# EAGLE design USBRA13a (EAGLE 5.11)
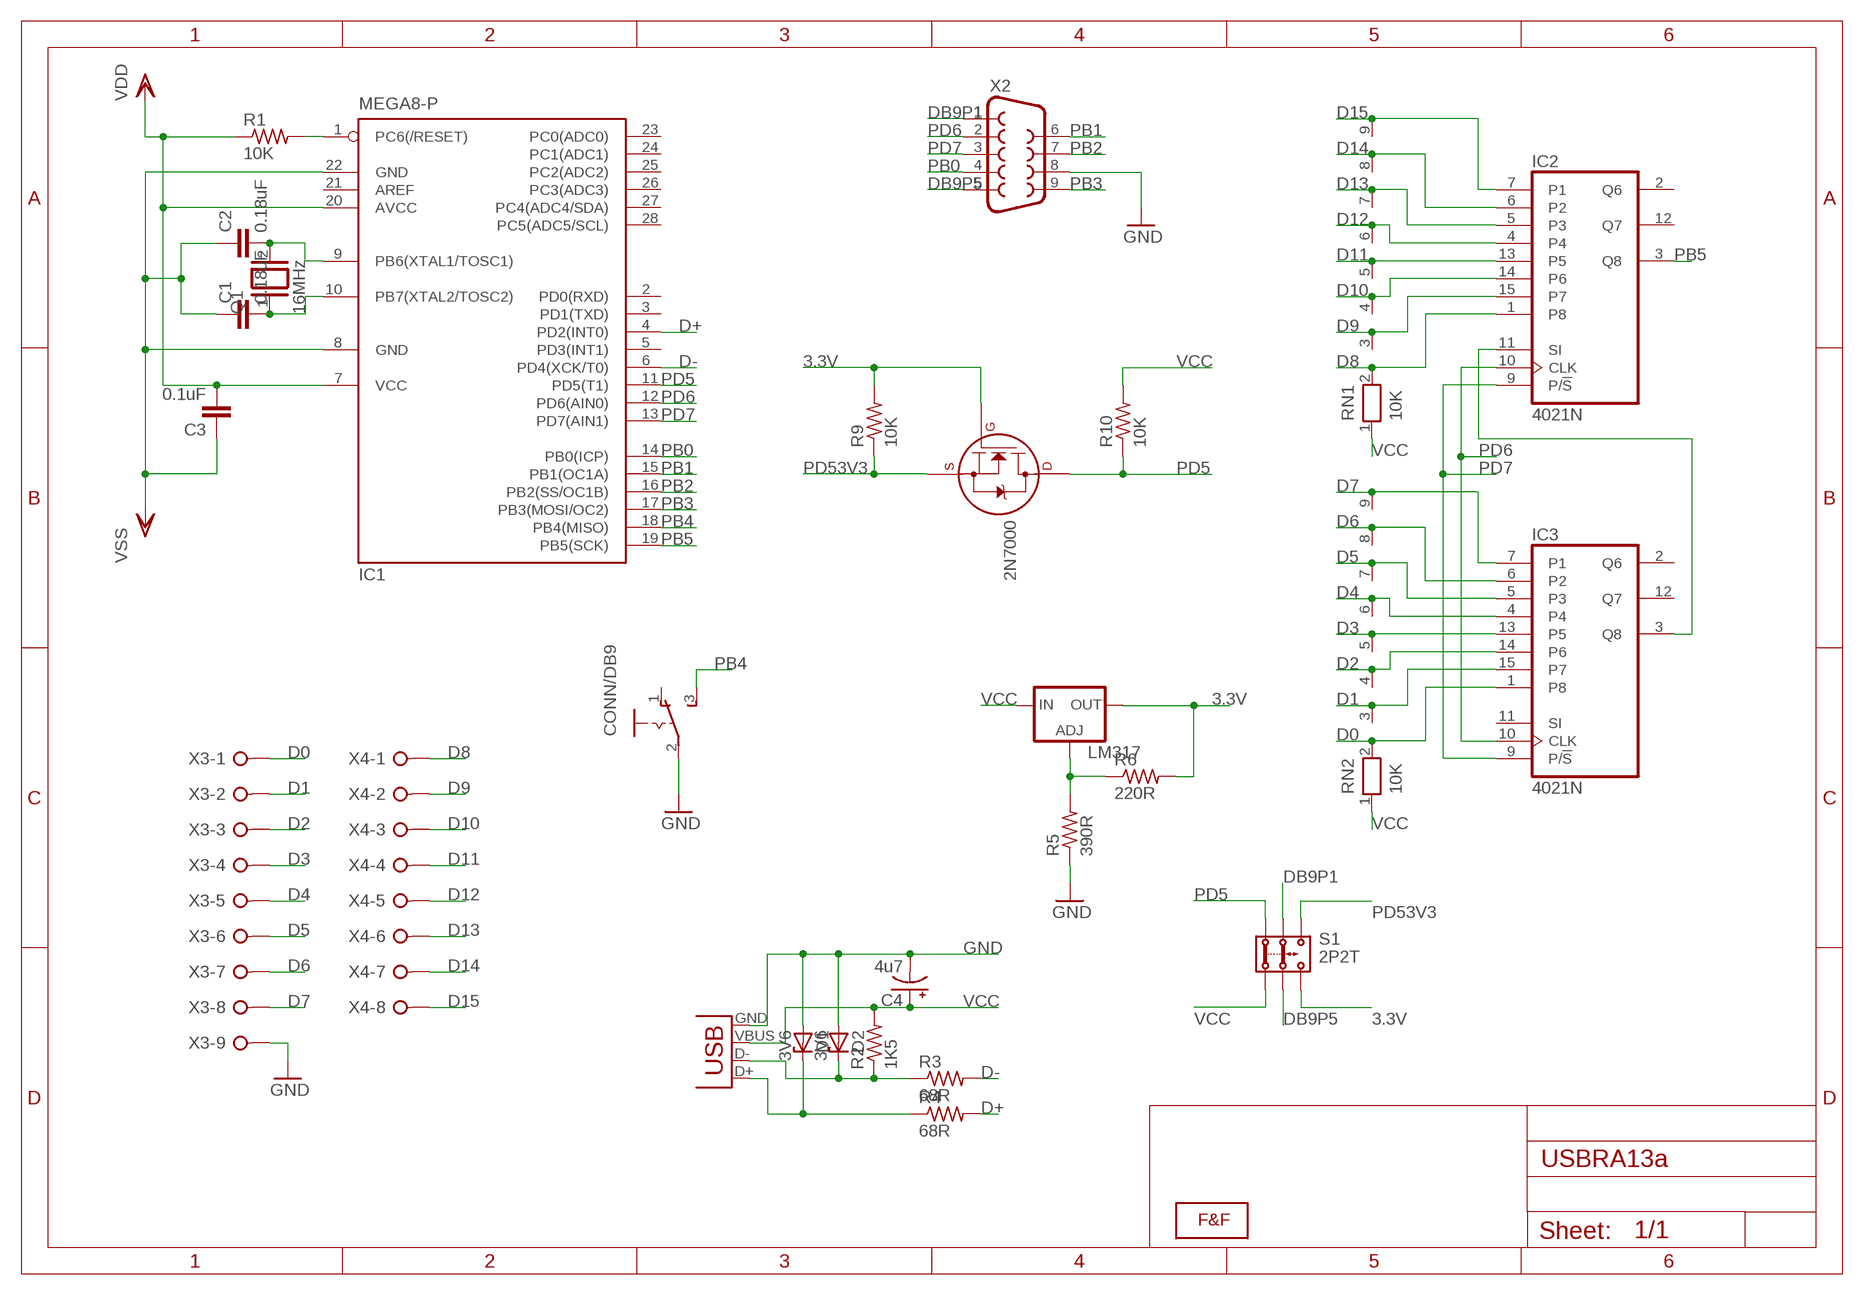
[diagram p0: schematic, sheet 1]

## Parts
2N7000  2N7000_TO92  [TO-92]
C1  0.18uF  C-EU050-024X044  [C050-024X044]
C2  0.18uF  C-EU050-024X044  [C050-024X044]
C3  0.1uF  C-EU050-024X044  [C050-024X044]
C4  4u7  CPOL-USE2.5-6  [E2,5-6]
CONN/DB9  CHAVE  [CHAVE]
D1  3V6  ZENER-DIODEZD-5  [ZDIO-5]
D2  3V6  ZENER-DIODEZD-5  [ZDIO-5]
IC1  MEGA8-P  [DIL28-3]
IC2  4021N  [DIL16]
IC3  4021N  [DIL16]
LM317  LM317TS  [317TS]
Q1  16MHz  XTAL/S  [QS]
R1  10K  R-US_0207/10  [0207/10]
R2  1K5  R-US_0207/10  [0207/10]
R3  68R  R-US_0207/10  [0207/10]
R4  68R  R-US_0207/10  [0207/10]
R5  390R  R-US_0207/10  [0207/10]
R6  220R  R-US_0207/10  [0207/10]
R9  10K  R-US_0207/10  [0207/10]
R10  10K  R-US_0207/10  [0207/10]
RN1  10K  RN08  [RN-9]
RN2  10K  RN08  [RN-9]
S1  2P2T  [2P2T]
U$1  LOGOLOGO_WITHOUT_SMOKE_BIG  [LOGO2_BIG]
X1  USBPTH  [USB-B-PTH]
X2  DB9MALE  [DB9_MALE]
X3  W237-09P  [W237-9P]
X4  W237-08P  [W237-8P]

## Nets
3.3V: 2N7000.2(G) LM317.2(OUT) R6.2 R9.2 S1.3.2
D0: IC3.1(P8) RN2.2 X3.1
D1: IC3.15(P7) RN2.3 X3.2
D2: IC3.14(P6) RN2.4 X3.3
D3: IC3.13(P5) RN2.5 X3.4
D4: IC3.4 RN2.6 X3.5
D5: IC3.5(P3) RN2.7 X3.6
D6: IC3.6(P2) RN2.8 X3.7
D7: IC3.7(P1) RN2.9 X3.8
D8: IC2.1(P8) RN1.2 X4.1
D9: IC2.15(P7) RN1.3 X4.2
D10: IC2.14(P6) RN1.4 X4.3
D11: IC2.13(P5) RN1.5 X4.4
D12: IC2.4 RN1.6 X4.5
D13: IC2.5(P3) RN1.7 X4.6
D14: IC2.6(P2) RN1.8 X4.7
D15: IC2.7(P1) RN1.9 X4.8
D+: IC1.4(PD2(INT0)) R4.2
D-: IC1.6(PD4(XCK/T0)) R3.2
DB9P1: S1.2.1 X2.1
DB9P5: S1.2.2 X2.5
GND: C1.1 C2.1 C3.1 C4.- CONN/DB9.2(P) D1.A D2.A IC1.8(GND) IC1.22(GND) R5.1 X1.GND X2.8 X3.9 ; supply symbol labelled VSS
N$1: IC1.1(PC6(/RESET)) R1.2
N$2: C2.2 IC1.9(PB6(XTAL1/TOSC1)) Q1.2
N$3: C1.2 IC1.10(PB7(XTAL2/TOSC2)) Q1.1
N$4: IC2.11(SI) IC3.3(Q8)
N$5: LM317.1(ADJ) R5.2 R6.1
N$8: D1.C R4.1 X1.D+
N$9: D2.C R2.1 R3.1 X1.D-
PB0: IC1.14(PB0(ICP)) X2.4
PB1: IC1.15(PB1(OC1A)) X2.6
PB2: IC1.16(PB2(SS/OC1B)) X2.7
PB3: IC1.17(PB3(MOSI/OC2)) X2.9
PB4: CONN/DB9.3(S) IC1.18(PB4(MISO))
PB5: IC1.19(PB5(SCK)) IC2.3(Q8)
PD5: 2N7000.3(D) IC1.11(PD5(T1)) R10.1 S1.1.1
PD6: IC1.12(PD6(AIN0)) IC2.10(CLK) IC3.10(CLK) X2.2
PD7: IC1.13(PD7(AIN1)) IC2.9(P/!S) IC3.9(P/!S) X2.3
PD53V3: 2N7000.1(S) R9.1 S1.3.1
VCC: C3.2 C4.+ IC1.7(VCC) IC1.20(AVCC) LM317.3(IN) R1.1 R2.2 R10.2 RN1.1 RN2.1 S1.1.2 X1.VBUS ; supply symbol labelled VDD
Unconnected: CONN/DB9.1(O) IC1.2(PD0(RXD)) IC1.3(PD1(TXD)) IC1.5(PD3(INT1)) IC1.21(AREF) IC1.23(PC0(ADC0)) IC1.24(PC1(ADC1)) IC1.25(PC2(ADC2)) IC1.26(PC3(ADC3)) IC1.27(PC4(ADC4/SDA)) IC1.28(PC5(ADC5/SCL)) IC2.2(Q6) IC2.12(Q7) IC3.2(Q6) IC3.11(SI) IC3.12(Q7)

## Power pins joined to a net without a drawn wire
GND: IC2.8(VSS) IC3.8(VSS)
VCC: IC2.16(VDD) IC3.16(VDD)

## Library data of the parts
2N7000 = transistors:2N700*: 2N7000, 2N7002, NDS7002A N-channel enhancement mode MOSFET
C1-C3 = rcl:C-EU: CAPACITOR, European symbol
C4 = adafruit:CPOL-US: POLARIZED CAPACITOR, American symbol
CONN/DB9 = switch-fef:CHAVE: chave Verificar
D1 D2 = diode:ZENER-DIODE: Z-Diode
IC1 = atmel:MEGA8-P: MICROCONTROLLER 8 Kbytes FLASH, 1 kbytes SRAM, 512 bytes EEPROM, USART, 4-channel 10 bit ADC, 2-channel 8 bit ADC Pin compatible with Atmega48, ATMega88, ATMega168 Source: avr.lbr; OC_FARNELL: unknown; OC_NEWARK: unknown
IC2 IC3 = 40xx:4021: 8-bit static SHIFT REGISTER
LM317 = v-reg:LM317TS: VOLTAGE REGULATOR
Q1 = special:XTAL/S: CRYSTAL
R1-R6 R9 R10 = adafruit:R-US_: RESISTOR, American symbol
RN1 RN2 = resistor-net:RN08: RESISTOR NETWORK; OC_FARNELL: unknown; OC_NEWARK: unknown
S1 = Itead_BP_110825:2P2T: BAS011
U$1 = F&F:LOGO: Faísca e Fumaça Logo faiscaefumaca.com.br
X1 = SparkFun:USB: USB Connectors USB-B-PTH is fully proven SKU : PRT-00139 USB-miniB is fully proven SKU : PRT-00587 USB-A-PCB is untested. USB-A-H is throughly reviewed, but untested. Spark Fun Electronics SKU : PRT-00437 USB-B-SMT is throughly reviewed, but untested. Needs silkscreen touching up. USB-A-S has not been used/tested USB-MB-H has not been used/tested
X2 = SparkFun:DB9: DB9 Connector Standard DB9 (D-Sub 9) serial connector. Can be used for CAN bus as well as RS485 and RS232. Footprint production proven. Spark Fun Electronics SKU : PRT-00429
X3 = con-wago-508:W237-09P: WAGO SREW CLAMP; OC_FARNELL: unknown; OC_NEWARK: unknown
X4 = con-wago-508:W237-08P: WAGO SREW CLAMP; OC_FARNELL: unknown; OC_NEWARK: unknown

## Board
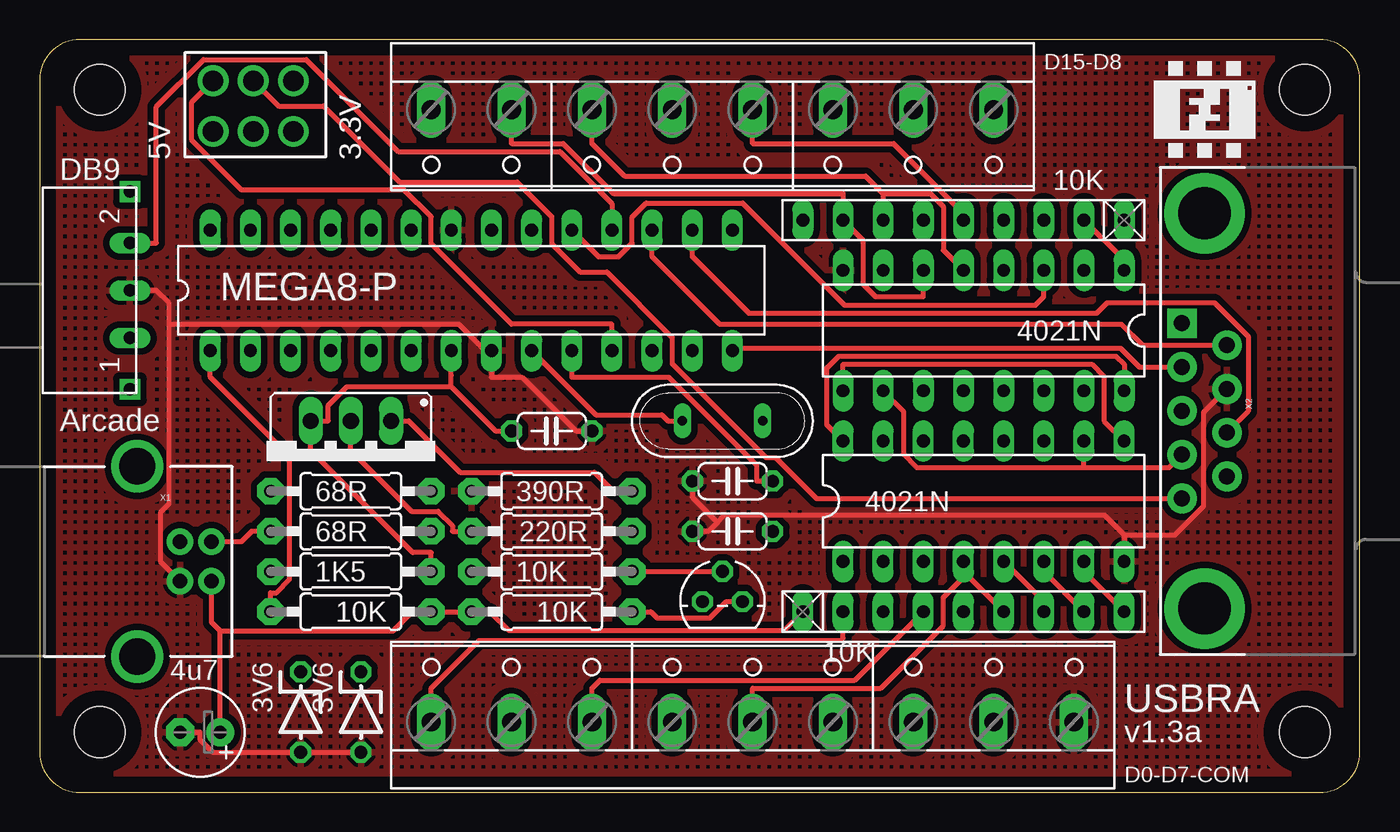
[diagram p1: board, top side]
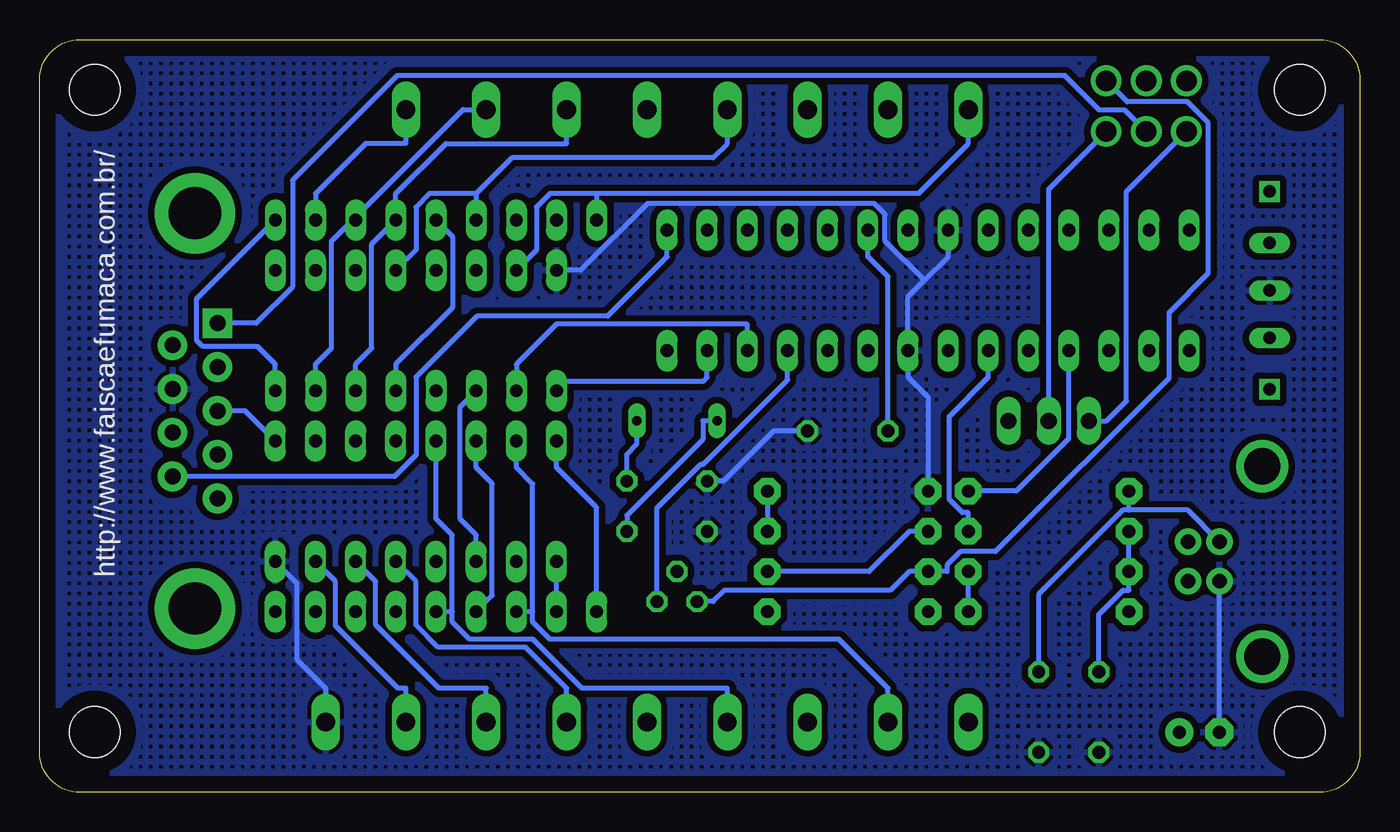
[diagram p2: board, bottom side, seen from below]

Size 83.49 x 47.62 mm. Coordinates in mm from the lower left corner, seen from the top.
Outline: 83.49,45.08 arc90 80.95,47.62 2.54,47.62 arc90 0,45.08 0,2.54 arc90 2.54,0 80.95,0 arc90 83.49,2.54 83.49,45.08
Copper layers (1*16): Top 0.035mm / dielectric 1.5mm / Bottom 0.035mm
Design rules "freerouter": minimum track width 12mil, minimum drill 24mil, track to track 8mil, track to pad 8mil, pad to pad 8mil, via to via 8mil, smd to smd 8mil, copper to edge 40mil, drill to drill 8mil, minimum pad ring 10mil, minimum via ring 8mil, stop-mask expansion 4mil, vias tented up to drill 0mil, thermal gap 10mil
Holes 3.2 mm at 3.81,44.45 3.81,3.81 80.01,44.45 80.01,3.81

### Footprints (pad centres in the part's own frame; a part is rotated, then mirrored left to right if it is on the bottom)
TO-92 = drill 0.813 octagon: 1 -1.27,0; 2 0,1.905; 3 1.27,0
C050-024X044 = drill 0.813 octagon: 1 -2.54,0; 2 2.54,0
E2,5-6 = drill 0.813 pad 1.778 round: + -1.27,0 | drill 0.813 pad 1.778 octagon: - 1.27,0
CHAVE = drill 0.8 long: 1 -3,0; 2 0,0; 3 3,0 | drill 0.8 square: P$1 -6.25,0; P$2 6.25,0
ZDIO-5 = drill 0.813 octagon: A 2.54,0; C -2.54,0
DIL28-3 = drill 0.813 long: 1 -16.51,-3.81; 2 -13.97,-3.81; 3 -11.43,-3.81; 4 -8.89,-3.81; 5 -6.35,-3.81; 6 -3.81,-3.81; 7 -1.27,-3.81; 8 1.27,-3.81; 9 3.81,-3.81; 10 6.35,-3.81; 11 8.89,-3.81; 12 11.43,-3.81; 13 13.97,-3.81; 14 16.51,-3.81; 15 16.51,3.81; 16 13.97,3.81; 17 11.43,3.81; 18 8.89,3.81; 19 6.35,3.81; 20 3.81,3.81; 21 1.27,3.81; 22 -1.27,3.81; 23 -3.81,3.81; 24 -6.35,3.81; 25 -8.89,3.81; 26 -11.43,3.81; 27 -13.97,3.81; 28 -16.51,3.81
DIL16 = drill 0.813 long: 1 -8.89,-3.81; 2 -6.35,-3.81; 3 -3.81,-3.81; 4 -1.27,-3.81; 5 1.27,-3.81; 6 3.81,-3.81; 7 6.35,-3.81; 8 8.89,-3.81; 9 8.89,3.81; 10 6.35,3.81; 11 3.81,3.81; 12 1.27,3.81; 13 -1.27,3.81; 14 -3.81,3.81; 15 -6.35,3.81; 16 -8.89,3.81
317TS = drill 1.016 long: 1 -2.54,-2.54; 2 0,-2.54; 3 2.54,-2.54
QS = drill 0.61 long: 1 -2.54,0; 2 2.54,0
0207/10 = drill 0.813 pad 1.676 octagon: 1 -5.08,0; 2 5.08,0
RN-9 = drill 0.813 long: 1 -10.16,0; 2 -7.62,0; 3 -5.08,0; 4 -2.54,0; 5 0,0; 6 2.54,0; 7 5.08,0; 8 7.62,0; 9 10.16,0
2P2T = drill 1.3 pad 1.93 round: 1.1 -3.635,-0.085; 1.2 -3.635,-3.285; 2.1 -1.095,-0.085; 2.2 -1.095,-3.285; 3.1 1.445,-0.085; 3.2 1.445,-3.285
USB-B-PTH = drill 0.914 pad 1.676 round: D+ 0,1.25; D- 1.981,1.25; GND 0,-1.25; VBUS 1.981,-1.25 | drill 2.286 round: S1 -2.718,-6.02; S2 -2.718,6.02
DB9_MALE = drill 1.016 pad 1.88 round: 1 5.54,-1.42; 2 2.77,-1.42; 3 0,-1.42; 4 -2.77,-1.42; 6 4.15,1.42; 7 1.38,1.42; 8 -1.38,1.42; 9 -4.15,1.42 | drill 1.016 pad 1.88 square: 5 -5.54,-1.42 | drill 3.302 pad 5.08 round: G1 -12.5,0; G2 12.5,0
W237-9P = drill 1.194 long: 1 -20.32,-0.635; 2 -15.24,-0.635; 3 -10.16,-0.635; 4 -5.08,-0.635; 5 0,-0.635; 6 5.08,-0.635; 7 10.16,-0.635; 8 15.24,-0.635; 9 20.32,-0.635
W237-8P = drill 1.194 long: 1 -17.78,-0.635; 2 -12.7,-0.635; 3 -7.62,-0.635; 4 -2.54,-0.635; 5 2.54,-0.635; 6 7.62,-0.635; 7 12.7,-0.635; 8 17.78,-0.635

### Placement (x,y rotation side)
2N7000  43.18,12.06 0 top
C1  43.81,19.68 0 top
C2  43.81,16.51 0 top
C3  32.38,22.86 180 top
C4  10.16,3.81 180 top
CONN/DB9  5.71,31.75 90 top
D1  20.32,5.08 270 top
D2  16.51,5.08 270 top
IC1  27.3,31.75 0 top
IC2  59.69,29.21 180 top
IC3  59.69,18.41 0 top
LM317  19.68,20.95 180 top
Q1  43.18,23.5 180 top
R1  19.68,11.43 180 top
R2  19.68,13.97 0 top
R3  19.68,16.51 0 top
R4  19.68,19.05 0 top
R5  32.38,19.05 0 top
R6  32.38,16.51 180 top
R9  32.38,13.97 0 top
R10  32.38,11.43 180 top
RN1  58.42,36.2 180 top
RN2  58.42,11.43 0 top
S1  14.61,45.09 0 top
U$1  73.66,43.18 0 top
X1  8.89,14.61 0 top
X2  73.66,24.13 270 top
X3  45.09,5.08 0 top
X4  42.55,42.55 180 top

### Tracks (layer width: path | path; a pad name or v marks a point on that pad's centre or on a via)
3.3V
  Top 0.305: R6.2 26.11,16.51 26.11,16.88 25.21,17.78 23.52,17.78 19.68,21.61 LM317.2 | R9.2 2N7000.2
  Bottom 0.305: S1.3.2 19.68,38.16 LM317.2 | R6.2 28.5,16.51 31.04,13.97 R9.2
D0
  Top 0.305: RN2.2 50.8,9.75 50.65,9.61 27.78,9.61 24.77,6.59 X3.1
  Bottom 0.305: RN2.2 IC3.1
D1
  Bottom 0.305: 52.31,11.43 RN2.3 | 52.31,11.43 52.31,10.78 51.22,9.69 32.94,9.69 29.84,6.59 X3.2 | 52.31,11.43 | 52.31,11.43 52.31,19.52 53.34,20.55 IC3.15
D2
  Top 0.305: X3.3 34.92,6.59 35.43,7.1 51.55,7.1 RN2.4
  Bottom 0.305: IC3.14 55.88,20.55 54.86,19.53 54.86,12.45 RN2.4
D3
  Bottom 0.305: 57.4,11.43 57.4,10.79 56.29,9.69 52.28,9.69 49.19,6.59 40.01,6.59 X3.4 | 57.4,11.43 | 57.4,11.43 RN2.5 | 57.4,11.43 57.4,16.28 58.42,17.3 IC3.13
D4
  Top 0.305: 58.61,13.78 58.42,13.97 IC3.4 | 58.61,13.78 RN2.6 | 58.61,13.78 57.15,12.32 57.15,10.55 53.2,6.59 45.09,6.59 X3.5
D5
  Top 0.305: IC3.5 63.5,12.06 RN2.7
  Bottom 0.305: X3.6 50.16,6.59 52.75,9.18 58.28,9.18 59.69,10.59 59.69,13.34 IC3.5
D6
  Top 0.305: RN2.8 63.5,13.97 IC3.6
  Bottom 0.305: X3.7 55.24,6.59 58.23,6.59 62.23,10.59 62.23,13.34 IC3.6
D7
  Top 0.305: RN2.9 66.04,13.97 IC3.7
  Bottom 0.305: X3.8 60.33,6.59 60.82,6.59 64.77,10.54 64.77,13.34 IC3.7
D8
  Top 0.305: RN1.2 68.58,33.66 IC2.1
  Bottom 0.305: RN1.2 66.04,37.87 62.88,41.03 60.33,41.03 X4.1
D9
  Bottom 0.305: X4.2 56.72,43.18 63.5,36.4 | IC2.15 66.04,27.08 65.02,28.09 65.02,34.87 63.5,36.4 | 63.5,36.4 RN1.3
D10
  Bottom 0.305: X4.3 50.16,41.03 57.8,41.03 60.96,37.87 RN1.4 62.48,34.67 62.48,28.09 63.5,27.08 IC2.14
D11
  Top 0.305: X4.4 45.09,41.03 54,41.03 58.42,36.61 RN1.5
  Bottom 0.305: IC2.13 60.96,27.08 57.39,30.65 57.39,35.16 RN1.5
D12
  Bottom 0.305: 55.88,37.87 58.84,37.87 59.69,37.02 59.69,34.29 IC2.4 | 55.88,37.87 55.88,37.74 RN1.6 | X4.5 40.01,41.03 40.9,40.14 53.61,40.14 55.88,37.87
D13
  Top 0.305: 53.34,37.87 56.33,37.87 57.15,37.05 57.15,34.29 IC2.5 | 53.34,37.87 53.34,37.74 RN1.7 | X4.6 34.92,41.03 36.98,38.98 52.24,38.98 53.34,37.87
D14
  Top 0.305: X4.7 29.84,41.03 33.12,41.03 36.28,37.87 50.8,37.87 RN1.8 52.07,34.92 52.07,32.14 52.87,31.34 55.88,31.34 IC2.6
D15
  Bottom 0.305: X4.8 24.77,41.03 27.93,37.87 48.26,37.87 | 48.26,37.87 RN1.9 | 48.26,37.87 51.22,37.87 52.07,37.02 52.07,34.29 IC2.7
D+
  Bottom 0.305: R4.2 21.74,19.05 18.41,22.37 IC1.4
D-
  Bottom 0.305: IC1.6 23.5,26.26 25.97,23.79 25.97,18.54 25.14,17.7 24.77,17.7 R3.2
DB9P1
  Top 0.305: X2.1 49.13,18.59 46.54,21.18 45.94,21.18 40.01,27.11 40.01,28.78 35.87,32.91 34.19,32.91 32.38,34.72 32.38,36.42 30.2,38.61 22.75,38.61 17.96,43.4 15.11,43.4 S1.2.1
DB9P5
  Bottom 0.305: X2.5 69.78,29.67 67.49,31.96 67.49,38.71 60.87,45.33 18.66,45.33 16.49,43.16 14.87,43.16 S1.2.2
GND
  Top 0.305: 42.86,17.08 42.29,16.51 C2.1 | 68.58,16.28 67.33,17.53 43.31,17.53 42.86,17.08 | 42.86,17.08 41.27,18.67 C1.1 | 68.58,16.28 68.58,16.15 IC3.8 | 68.58,16.28 71.79,16.28 73.62,18.11 73.62,24.05 X2.8 | 8.19,29.62 8.19,30.94 7.38,31.75 CONN/DB9.2 | X1.GND 7.67,14.57 7.67,17.75 8.19,18.27 8.19,29.62 | 28.57,27.54 26.5,29.62 8.19,29.62 | 28.57,27.54 28.57,26.26 30.5,26.26 33.91,22.86 34.42,22.86 C3.1 | 28.57,27.54 IC1.8 | C4.- 10.13,3.81 10.13,3.34 10.94,2.54 D2.A D1.A
  Bottom 0.305: C1.1 40.26,19.68 37.08,22.86 C3.1 | R5.1 27.3,24.99 28.57,26.26 IC1.8 28.57,31.34 27.53,32.39 | 27.53,32.39 26.04,33.88 IC1.22 | IC2.8 49.27,33.02 45.04,37.25 30.7,37.25 30.02,36.57 30.02,34.88 27.53,32.39 | IC3.8 67.23,13.26 67.23,8.42 65.41,6.59 X3.9 | C4.- X1.GND
  pour Bottom (isolate 0.406, hatched): 0,46.99 83.82,46.99 83.82,0 0,0
  pour Top (isolate 0.406, hatched): 0,46.99 83.82,46.99 83.82,0 0,0
N$1
  Top 0.305: IC1.1 10.79,26.26 15.81,21.25 15.81,13.46 14.98,12.62 14.61,12.62 R1.2
N$2
  Top 0.305: Q1.2 39.73,23.5 39.34,23.88 35.18,23.88 IC1.9
  Bottom 0.305: C2.2 46.35,17.53 41.55,22.33 41.55,23.5 Q1.2
N$3
  Top 0.305: C1.2 45.34,19.68 45.34,20.7 39.78,26.26 33.66,26.26 IC1.10
  Bottom 0.305: Q1.1 45.72,22.02 46.35,21.39 C1.2
N$4
  Bottom 0.305: IC3.3 55.88,16.28 56.9,17.3 56.9,24.38 IC2.11
N$5
  Top 0.305: LM317.1 23.34,23.5 26.59,20.24 35.08,20.24 36.27,19.05 R5.2
  Bottom 0.305: R5.2 R6.1
N$8
  Bottom 0.305: X1.D+ 10.89,17.86 14.61,17.86 | 14.61,17.86 R4.1 | 14.61,17.86 14.98,17.86 20.32,12.51 D1.C
N$9
  Top 0.305: R3.1 13.41,16.51 12.76,15.86 X1.D-
  Bottom 0.305: D2.C 16.51,11.24 14.98,12.78 14.61,12.78 R2.1 R3.1
PB0
  Top 0.305: X2.4 69.55,26.9 68.35,28.1 43.97,28.1 IC1.14
PB1
  Bottom 0.305: IC1.15 43.81,33.88 47.57,30.12 55.84,30.12 59.69,26.27 59.69,21.34 61.05,19.98 X2.6
PB2
  Top 0.305: X2.7 76.43,24.1 76.43,28.83 74.3,30.97 67.5,30.97 66.85,30.31 44.85,30.31 41.27,33.88 IC1.16
PB3
  Top 0.305: X2.9 69.75,28.28 68.41,29.62 43,29.62 38.73,33.88 IC1.17
PB4
  Top 0.305: CONN/DB9.3 7.38,34.75 7.38,43.36 10.36,46.34 16.86,46.34 22.68,40.52 32.91,40.52 36.2,37.24 IC1.18
PB5
  Top 0.305: IC2.3 63.5,31.34 62.98,30.82 50.9,30.82 44.45,37.27 38.35,37.27 37.47,36.39 37.47,34.73 36.61,33.88 35.34,33.88 IC1.19
PD5
  Top 0.305: IC1.11 36.2,29.62 29.84,29.62 24.77,34.7 24.77,36.4 23.07,38.1 12.77,38.1 9.62,41.24 9.62,43.66 S1.1.1 | 2N7000.3 43.43,12.06 42.4,11.03 39.05,11.03 38.66,11.43 R10.1
  Bottom 0.305: IC1.11 36.2,26.09 41.54,20.74 41.7,20.74 44.45,17.99 2N7000.3
PD6
  Top 0.305: 66.04,20.55 55.45,20.55 54.61,21.39 54.61,24.13 IC2.10 | X2.2 71.43,20.55 66.04,20.55 | 66.04,20.55 IC3.10
  Bottom 0.305: IC1.12 38.73,29.62 50.8,29.62 53.34,27.08 IC2.10
PD7
  Top 0.305: IC2.9 50.8,27.08 66.53,27.08 67.31,26.29 67.31,23.5 IC3.9
  Bottom 0.305: X2.3 70.48,24.13 IC3.9 | IC1.13 41.27,26.26 41.54,26 50.8,26 IC2.9
PD53V3
  Bottom 0.305: 2N7000.1 40.89,12.06 40.18,12.78 29.69,12.78 28.5,13.97 R9.1 26.71,13.97 26.11,13.97 26.11,14.38 25.25,15.24 23.04,15.24 12.06,26.21 12.06,30.36 9.59,32.83 9.59,42.35 10.91,43.67 14.72,43.67 S1.3.1
VCC
  Top 0.305: IC2.16 68.58,27.08 68.07,27.59 50.54,27.59 49.78,26.83 49.78,23.25 IC3.16 | 11.43,10.2 10.87,10.76 X1.VBUS | 11.43,10.2 22.34,10.2 23.57,11.43 R1.1 R10.2 28.5,11.43 29.69,10.24 47.07,10.24 RN2.1 | C4.+ 11.43,10.2 | 26.04,25.65 28.83,22.86 C3.2 | 26.04,25.65 26.04,26.39 IC1.7 | 26.04,25.65 19.44,25.65 18.26,24.47 18.26,23.5 LM317.3 17.14,21.61 23.6,15.16 24.77,15.16 R2.2
  Bottom 0.305: IC2.16 68.58,27.08 69.71,28.2 73.17,28.2 73.54,28.57 73.54,31.23 RN1.1 | LM317.3 16.03,23.5 14.77,24.75 14.77,38 S1.1.2 | IC3.16 50.8,20.55 48.26,18.01 RN2.1 | IC1.20 31.11,33.88 29.84,32.61 C3.2 | R1.1 R2.2

### Text on the board
tPlace: D15-D8 | 5V | 3.3V | DB9 | Arcade | USBRA | v1.3a | D0-D7-COM
bPlace: http://www.faiscaefumaca.com.br/